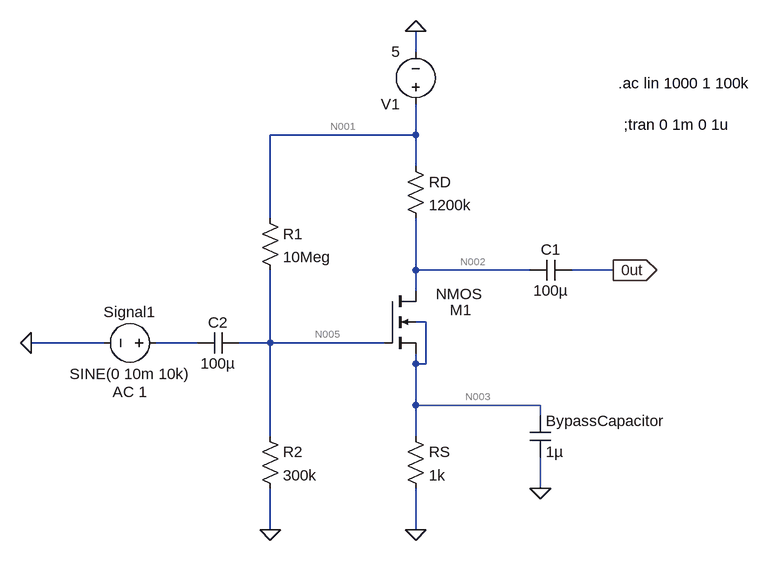
[diagram p0: schematic VDR.asc]
VDR.asc, the LTspice schematic file:
Version 4
SHEET 1 880 680
WIRE 192 -256 192 -288
WIRE 192 -128 192 -176
WIRE 192 -128 -32 -128
WIRE 192 -80 192 -128
WIRE -32 0 -32 -128
WIRE 192 80 192 0
WIRE 368 80 192 80
WIRE 496 80 432 80
WIRE 192 112 192 80
WIRE 208 160 192 160
WIRE -288 192 -400 192
WIRE -144 192 -208 192
WIRE -32 192 -32 80
WIRE -32 192 -80 192
WIRE 144 192 -32 192
WIRE 192 224 192 208
WIRE 208 224 208 160
WIRE 208 224 192 224
WIRE 192 288 192 224
WIRE 384 288 192 288
WIRE 384 304 384 288
WIRE -32 336 -32 192
WIRE 192 336 192 288
WIRE 384 416 384 368
WIRE -32 480 -32 416
WIRE 192 480 192 416
FLAG 496 80 0ut
IOPIN 496 80 Out
FLAG 192 -288 0
FLAG -32 480 0
FLAG -400 192 0
FLAG 192 480 0
FLAG 384 416 0
SYMBOL res 176 -96 R0
SYMATTR InstName RD
SYMATTR Value 1200k
SYMBOL nmos4 144 112 R0
WINDOW 0 101 29 Left 2
WINDOW 3 79 5 Left 2
SYMATTR InstName M1
SYMATTR Value2 l=0.18u w=1.8u
SYMBOL voltage 192 -160 R180
WINDOW 123 0 0 Left 0
WINDOW 39 0 0 Left 0
SYMATTR InstName V1
SYMATTR Value 5
SYMBOL voltage -192 192 R90
WINDOW 0 -32 56 VBottom 2
WINDOW 3 32 56 VTop 2
WINDOW 123 60 56 VTop 2
WINDOW 39 0 0 Left 0
SYMATTR InstName Signal1
SYMATTR Value SINE(0 10m 10k)
SYMATTR Value2 AC 1
SYMBOL cap 432 64 R90
WINDOW 0 0 32 VBottom 2
WINDOW 3 32 32 VTop 2
SYMATTR InstName C1
SYMATTR Value 100µ
SYMBOL res -48 -16 R0
SYMATTR InstName R1
SYMATTR Value 10Meg
SYMBOL res -48 320 R0
SYMATTR InstName R2
SYMATTR Value 300k
SYMBOL cap -80 176 R90
WINDOW 0 0 32 VBottom 2
WINDOW 3 32 32 VTop 2
SYMATTR InstName C2
SYMATTR Value 100µ
SYMBOL res 176 320 R0
SYMATTR InstName RS
SYMATTR Value 1k
SYMBOL cap 368 304 R0
SYMATTR InstName BypassCapacitor
SYMATTR Value 1µ
TEXT 504 -208 Left 2 !.ac lin 1000 1 100k
TEXT 512 -144 Left 2 !;tran 0 1m 0 1u

The netlist it stands for:
* VDR.asc
RD N001 N002 1200k
M1 N002 N005 N003 N003 NMOS l=0.18u w=1.8u
V1 N001 0 5
V§Signal1 N004 0 SINE(0 10m 10k) AC 1
C1 0ut N002 100µ
R1 N001 N005 10Meg
R2 N005 0 300k
C2 N005 N004 100µ
RS N003 0 1k
C§BypassCapacitor N003 0 1µ
.model NMOS NMOS
.model PMOS PMOS
.lib standard.mos
.ac lin 1000 1 100k
;tran 0 1m 0 1u
.backanno
.end

* Results of the author's LTspice run, read from the files saved beside the schematic
* Operating Point, zero values left out:
*   V(n001) = 5 V
*   V(n002) = 2.527 V
*   V(n005) = 145.6 mV
*   V(n003) = 2.061 mV
*   V(0ut) = 252.6 µV
*   Id(M1) = 2.061 µA
*   Ib(M1) = -2.534 pA
*   Is(M1) = -2.061 µA
*   I(Rs) = 2.061 µA
*   I(R2) = 485.4 nA
*   I(R1) = 485.4 nA
*   I(Rd) = 2.061 µA
*   I(V1) = -2.547 µA
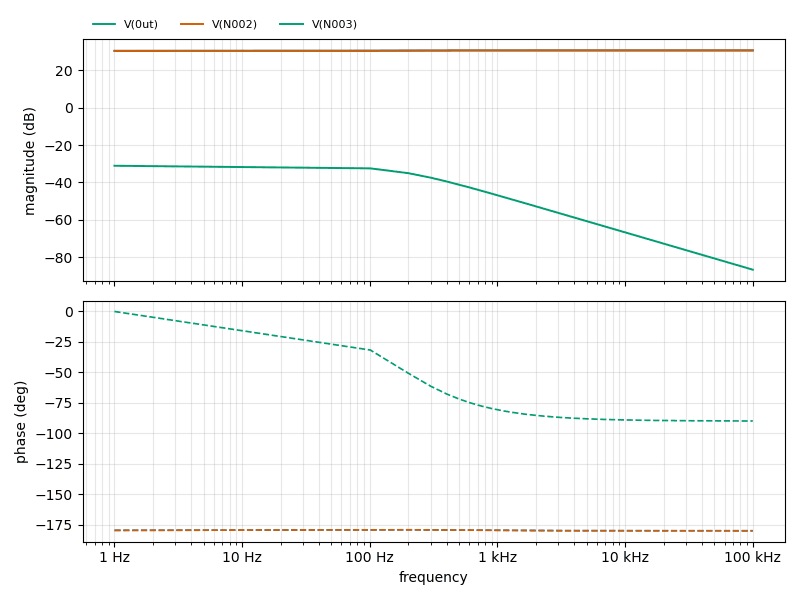
[diagram p1: AC Analysis of VDR.asc, plotted from the saved traces]
* AC Analysis, 1 run:
*   V(0ut): 30.50 dB at 1 Hz, 30.75 dB at 100 kHz, peak 30.75 dB at 100 kHz
*   V(N002): 30.50 dB at 1 Hz, 30.75 dB at 100 kHz, peak 30.75 dB at 100 kHz
*   V(N003): -31.08 dB at 1 Hz, -86.80 dB at 100 kHz, peak -31.08 dB at 1 Hz, 3 dB below the peak at 154.9 Hz